# EAGLE board rjcar (EAGLE 5.10), part 1 of 2
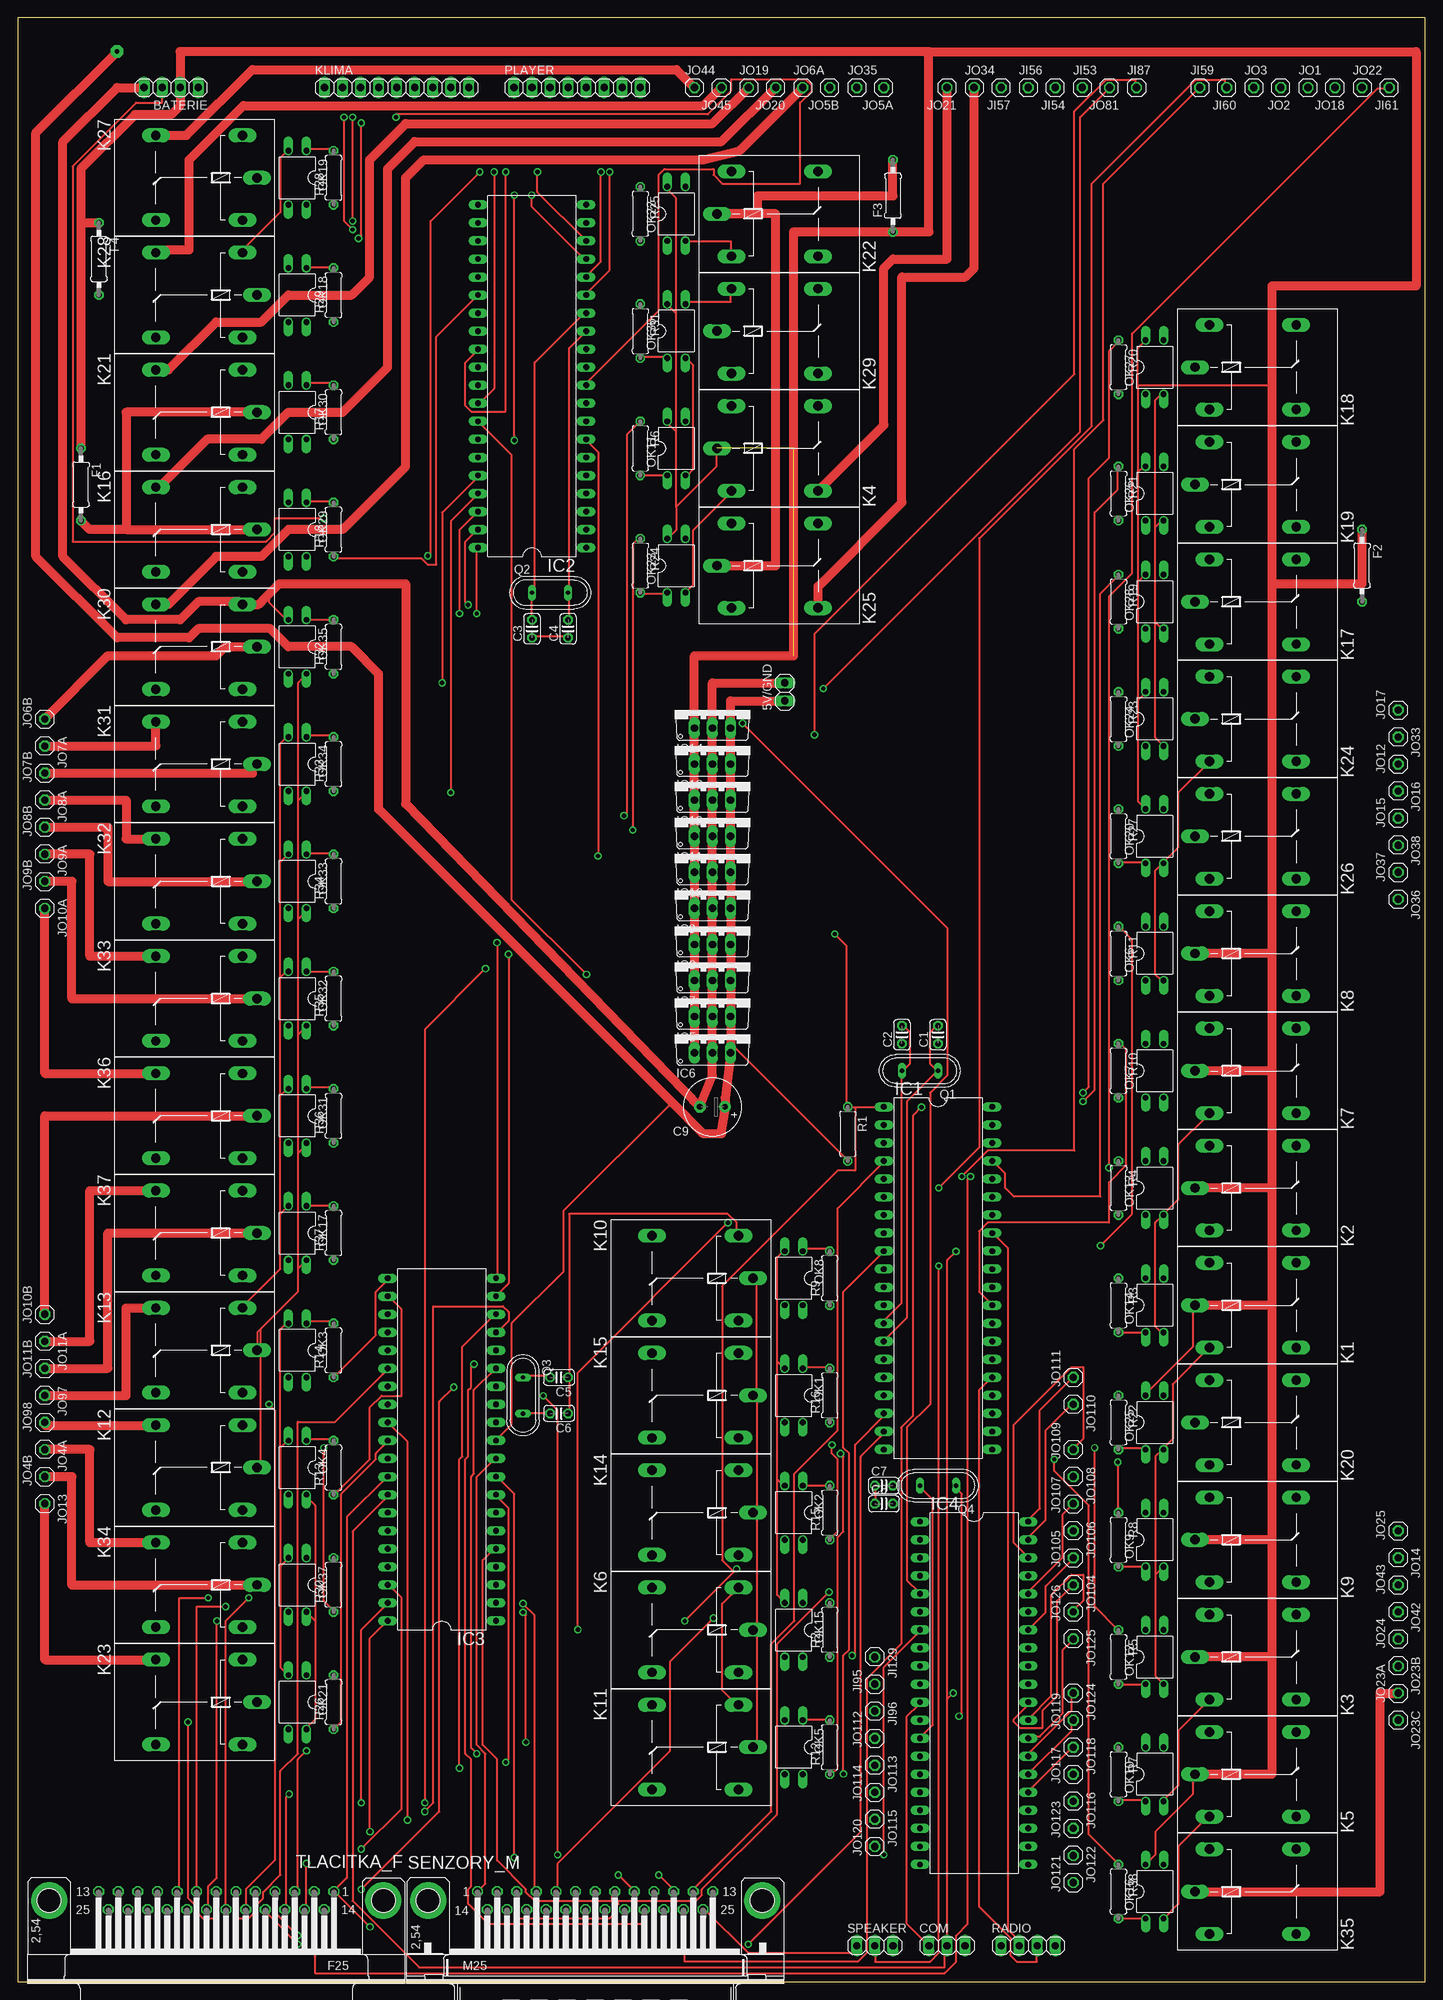
[diagram p2: board, top side]
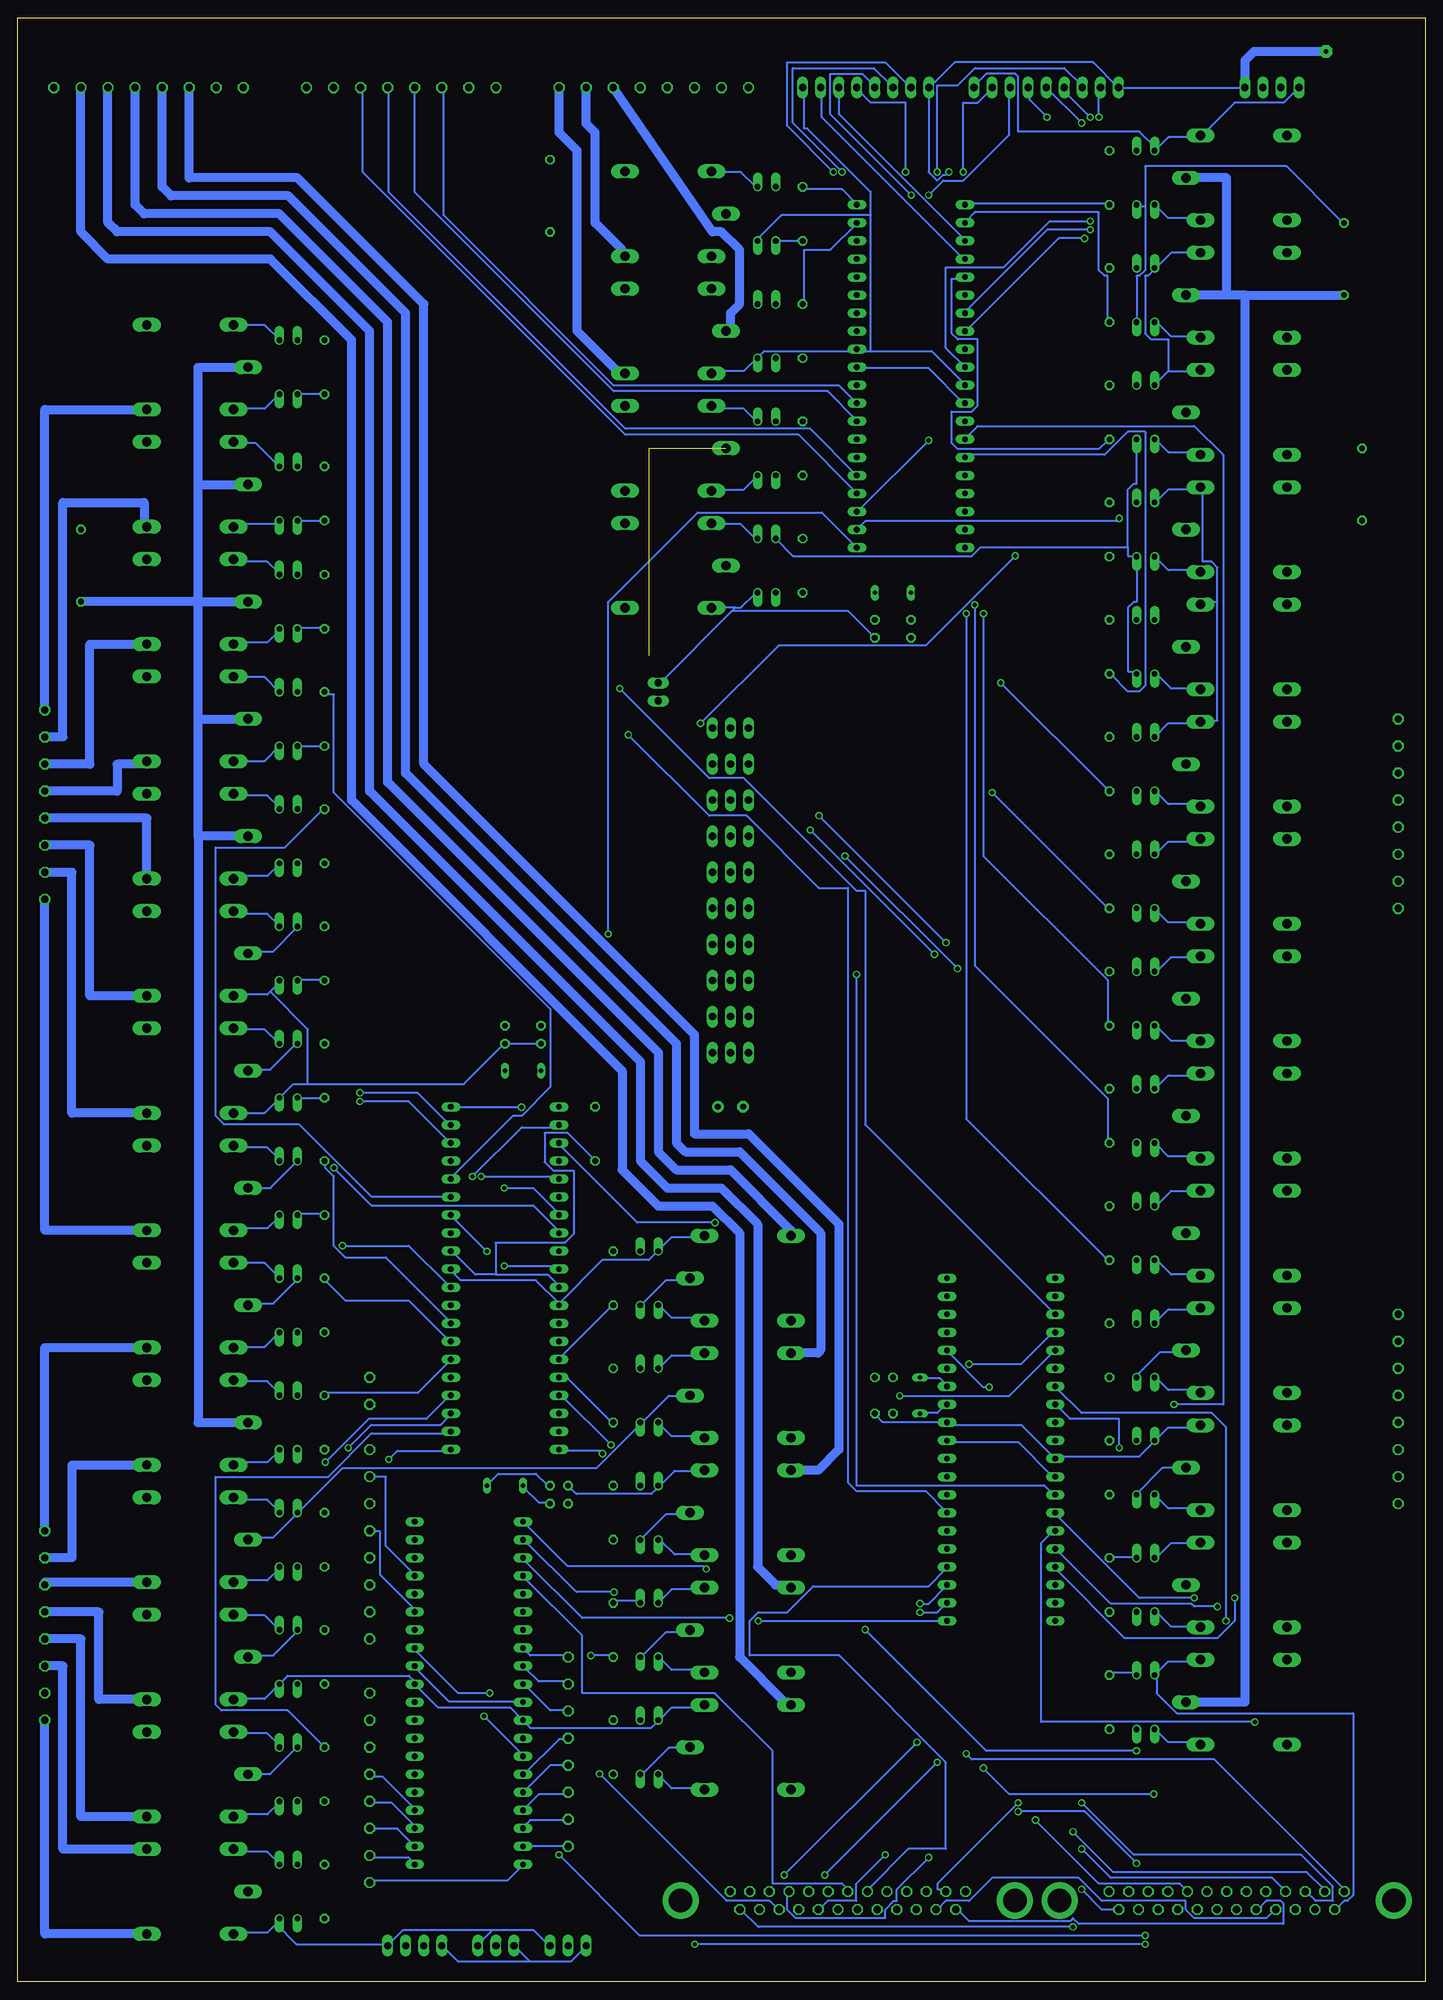
[diagram p3: board, bottom side, seen from below]

Size 198.1 x 276.53 mm. Coordinates in mm from the lower left corner, seen from the top.
Outline: 0,0 198.1,0 198.1,276.53 0,276.53 0,0
Copper layers (1*16): Top 0.035mm / dielectric 1.5mm / Bottom 0.035mm
Design rules "default": minimum track width 10mil, minimum drill 24mil, track to track 8mil, track to pad 8mil, pad to pad 8mil, via to via 8mil, smd to smd 8mil, copper to edge 40mil, drill to drill 8mil, minimum pad ring 10mil, minimum via ring 8mil, stop-mask expansion 4mil, vias tented up to drill 0mil, thermal gap 10mil

## Footprints (pad centres in the part's own frame; a part is rotated, then mirrored left to right if it is on the bottom)
1X02 = drill 1.016 long: 1 -1.27,0; 2 1.27,0
1X04 = drill 1.016 long: 1 -3.81,0; 2 -1.27,0; 3 1.27,0; 4 3.81,0
C025-024X044 = drill 0.813 octagon: 1 -1.27,0; 2 1.27,0
E3,5-8 = drill 0.813 pad 1.6 round: + -1.778,0 | drill 0.813 pad 1.6 octagon: - 1.778,0
1X03 = drill 1.016 long: 1 -2.54,0; 2 0,0; 3 2.54,0
0207/10 = drill 0.813 octagon: 1 -5.08,0; 2 5.08,0
DIL40 = drill 0.813 long: 1 -24.13,-7.62; 2 -21.59,-7.62; 3 -19.05,-7.62; 4 -16.51,-7.62; 5 -13.97,-7.62; 6 -11.43,-7.62; 7 -8.89,-7.62; 8 -6.35,-7.62; 9 -3.81,-7.62; 10 -1.27,-7.62; 11 1.27,-7.62; 12 3.81,-7.62; 13 6.35,-7.62; 14 8.89,-7.62; 15 11.43,-7.62; 16 13.97,-7.62; 17 16.51,-7.62; 18 19.05,-7.62; 19 21.59,-7.62; 20 24.13,-7.62; 21 24.13,7.62; 22 21.59,7.62; 23 19.05,7.62; 24 16.51,7.62; 25 13.97,7.62; 26 11.43,7.62; 27 8.89,7.62; 28 6.35,7.62; 29 3.81,7.62; 30 1.27,7.62; 31 -1.27,7.62; 32 -3.81,7.62; 33 -6.35,7.62; 34 -8.89,7.62; 35 -11.43,7.62; 36 -13.97,7.62; 37 -16.51,7.62; 38 -19.05,7.62; 39 -21.59,7.62; 40 -24.13,7.62
TO220V = drill 1.016 long: 1 -2.54,-2.54; 2 0,-2.54; 3 2.54,-2.54
1X01 = drill 1.016 octagon: 1 0,0
G5LE = drill 1.321 long: 1 -7.493,-5.969; 2 -7.493,5.969; O 4.699,5.969; P -9.525,0; S 4.699,-5.969
1X09 = drill 1.016 long: 1 -10.16,0; 2 -7.62,0; 3 -5.08,0; 4 -2.54,0; 5 0,0; 6 2.54,0; 7 5.08,0; 8 7.62,0; 9 10.16,0
DIL04 = drill 0.813 offset: 1 -1.27,-3.81; 2 1.27,-3.81; 3 1.27,3.81; 4 -1.27,3.81
1X08 = drill 1.016 long: 1 -8.89,0; 2 -6.35,0; 3 -3.81,0; 4 -1.27,0; 5 1.27,0; 6 3.81,0; 7 6.35,0; 8 8.89,0
QS = drill 0.61 long: 1 -2.54,0; 2 2.54,0
0207/7 = drill 0.813 octagon: 1 -3.81,0; 2 3.81,0
M25HP = drill 1.016 octagon: 1 -16.561,1.27; 2 -13.792,1.27; 3 -11.049,1.27; 4 -8.28,1.27; 5 -5.512,1.27; 6 -2.769,1.27; 7 0,1.27; 8 2.769,1.27; 9 5.512,1.27; 10 8.28,1.27; 11 11.049,1.27; 12 13.792,1.27; 13 16.561,1.27; 14 -15.189,-1.27; 15 -12.421,-1.27; 16 -9.652,-1.27; 17 -6.909,-1.27; 18 -4.14,-1.27; 19 -1.372,-1.27; 20 1.372,-1.27; 21 4.14,-1.27; 22 6.909,-1.27; 23 9.652,-1.27; 24 12.421,-1.27; 25 15.189,-1.27 | drill 3.302 pad 5.08 round: G1 -23.52,0; G2 23.52,0
F25HP = drill 1.016 octagon: 1 -16.561,-1.27; 2 -13.792,-1.27; 3 -11.049,-1.27; 4 -8.28,-1.27; 5 -5.512,-1.27; 6 -2.769,-1.27; 7 0,-1.27; 8 2.769,-1.27; 9 5.512,-1.27; 10 8.28,-1.27; 11 11.049,-1.27; 12 13.792,-1.27; 13 16.561,-1.27; 14 -15.189,1.27; 15 -12.421,1.27; 16 -9.652,1.27; 17 -6.909,1.27; 18 -4.14,1.27; 19 -1.372,1.27; 20 1.372,1.27; 21 4.14,1.27; 22 6.909,1.27; 23 9.652,1.27; 24 12.421,1.27; 25 15.189,1.27 | drill 3.302 pad 5.08 round: G1 -23.52,0; G2 23.52,0

## Placement (x,y rotation side)
5V/GND  [1X02]  107.95,181.61 90 top
BATERIE  [1X04]  21.59,266.7 180 top
C1  22p  [C025-024X044]  129.54,133.35 90 top
C2  22p  [C025-024X044]  124.46,133.35 90 top
C3  22p  [C025-024X044]  72.39,190.5 90 top
C4  22p  [C025-024X044]  77.47,190.5 90 top
C5  22p  [C025-024X044]  76.2,85.09 180 top
C6  22p  [C025-024X044]  76.2,80.01 180 top
C7  22p  [C025-024X044]  121.92,69.85 0 top
C8  22p  [C025-024X044]  121.92,67.31 0 top
C9  [E3,5-8]  97.79,123.19 180 top
COM  [1X03]  130.81,5.08 0 top
F1  [0207/10]  8.89,210.82 270 top
F2  [0207/10]  189.23,199.39 270 top
F3  [0207/10]  123.19,251.46 90 top
F4  [0207/10]  11.43,242.57 270 top
IC1  PIC16F874P  [DIL40]  129.54,99.06 270 top
IC2  PIC16F874P  [DIL40]  72.39,226.06 90 top
IC3  PIC16F874P  [DIL40]  59.69,74.93 90 top
IC4  PIC16F874P  [DIL40]  134.62,40.64 270 top
IC5  7805TV  [TO220V]  97.79,138.43 0 top
IC6  7805TV  [TO220V]  97.79,133.35 0 top
IC7  7805TV  [TO220V]  97.79,143.51 0 top
IC8  7805TV  [TO220V]  97.79,148.59 0 top
IC9  7805TV  [TO220V]  97.79,153.67 0 top
IC10  7805TV  [TO220V]  97.79,158.75 0 top
IC11  7805TV  [TO220V]  97.79,163.83 0 top
IC12  7805TV  [TO220V]  97.79,168.91 0 top
IC13  7805TV  [TO220V]  97.79,173.99 0 top
IC14  7805TV  [TO220V]  97.79,179.07 0 top
JI53  [1X01]  149.86,266.7 0 top
JI54  [1X01]  146.05,266.7 180 top
JI56  [1X01]  142.24,266.7 0 top
JI57  [1X01]  138.43,266.7 180 top
JI59  [1X01]  166.37,266.7 0 top
JI60  [1X01]  170.18,266.7 180 top
JI61  [1X01]  193.04,266.7 180 top
JI87  [1X01]  157.48,266.7 0 top
JI95  [1X01]  120.65,41.91 90 top
JI96  [1X01]  120.65,38.1 270 top
JI129  [1X01]  120.65,45.72 270 top
JO1  [1X01]  181.61,266.7 0 top
JO2  [1X01]  177.8,266.7 180 top
JO3  [1X01]  173.99,266.7 0 top
JO4A  [1X01]  3.81,74.93 270 top
JO4B  [1X01]  3.81,71.12 90 top
JO5A  [1X01]  121.92,266.7 180 top
JO5B  [1X01]  114.3,266.7 180 top
JO6A  [1X01]  110.49,266.7 0 top
JO6B  [1X01]  3.81,177.8 90 top
JO7A  [1X01]  3.81,173.99 270 top
JO7B  [1X01]  3.81,170.18 90 top
JO8A  [1X01]  3.81,166.37 270 top
JO8B  [1X01]  3.81,162.56 90 top
JO9A  [1X01]  3.81,158.75 270 top
JO9B  [1X01]  3.81,154.94 90 top
JO10A  [1X01]  3.81,151.13 270 top
JO10B  [1X01]  3.81,93.98 90 top
JO11A  [1X01]  3.81,90.17 270 top
JO11B  [1X01]  3.81,86.36 90 top
JO12  [1X01]  194.31,171.45 90 top
JO13  [1X01]  3.81,67.31 270 top
JO14  [1X01]  194.31,59.69 270 top
JO15  [1X01]  194.31,163.83 90 top
JO16  [1X01]  194.31,167.64 270 top
JO17  [1X01]  194.31,179.07 90 top
JO18  [1X01]  185.42,266.7 180 top
JO19  [1X01]  102.87,266.7 0 top
JO20  [1X01]  106.68,266.7 180 top
JO21  [1X01]  130.81,266.7 180 top
JO22  [1X01]  189.23,266.7 0 top
JO23A  [1X01]  194.31,40.64 90 top
JO23B  [1X01]  194.31,44.45 270 top
JO23C  [1X01]  194.31,36.83 270 top
JO24  [1X01]  194.31,48.26 90 top
JO25  [1X01]  194.31,63.5 90 top
JO33  [1X01]  194.31,175.26 270 top
JO34  [1X01]  134.62,266.7 0 top
JO35  [1X01]  118.11,266.7 0 top
JO36  [1X01]  194.31,152.4 270 top
JO37  [1X01]  194.31,156.21 90 top
JO38  [1X01]  194.31,160.02 270 top
JO42  [1X01]  194.31,52.07 270 top
JO43  [1X01]  194.31,55.88 90 top
JO44  [1X01]  95.25,266.7 0 top
JO45  [1X01]  99.06,266.7 180 top
JO81  [1X01]  153.67,266.7 180 top
JO97  [1X01]  3.81,82.55 270 top
JO98  [1X01]  3.81,78.74 90 top
JO104  [1X01]  148.59,55.88 270 top
JO105  [1X01]  148.59,59.69 90 top
JO106  [1X01]  148.59,63.5 270 top
JO107  [1X01]  148.59,67.31 90 top
JO108  [1X01]  148.59,71.12 270 top
JO109  [1X01]  148.59,74.93 90 top
JO110  [1X01]  148.59,81.28 270 top
JO111  [1X01]  148.59,85.09 90 top
JO112  [1X01]  120.65,34.29 90 top
JO113  [1X01]  120.65,30.48 270 top
JO114  [1X01]  120.65,26.67 90 top
JO115  [1X01]  120.65,22.86 270 top
JO116  [1X01]  148.59,25.4 270 top
JO117  [1X01]  148.59,29.21 90 top
JO118  [1X01]  148.59,33.02 270 top
JO119  [1X01]  148.59,36.83 90 top
JO120  [1X01]  120.65,19.05 90 top
JO121  [1X01]  148.59,13.97 90 top
JO122  [1X01]  148.59,17.78 270 top
JO123  [1X01]  148.59,21.59 90 top
JO124  [1X01]  148.59,40.64 270 top
JO125  [1X01]  148.59,48.26 270 top
JO126  [1X01]  148.59,52.07 90 top
K1  G5LE  [G5LE]  175.26,95.25 0 top
K2  G5LE  [G5LE]  175.26,111.76 0 top
K3  G5LE  [G5LE]  175.26,45.72 0 top
K4  G5LE  [G5LE]  107.95,215.9 0 top
K5  G5LE  [G5LE]  175.26,29.21 0 top
K6  G5LE  [G5LE]  93.98,49.53 180 top
K7  G5LE  [G5LE]  175.26,128.27 0 top
K8  G5LE  [G5LE]  175.26,144.78 0 top
K9  G5LE  [G5LE]  175.26,62.23 0 top
K10  G5LE  [G5LE]  93.98,99.06 180 top
K11  G5LE  [G5LE]  93.98,33.02 180 top
K12  G5LE  [G5LE]  24.13,72.39 180 top
K13  G5LE  [G5LE]  24.13,88.9 180 top
K14  G5LE  [G5LE]  93.98,66.04 180 top
K15  G5LE  [G5LE]  93.98,82.55 180 top
K16  G5LE  [G5LE]  24.13,204.47 180 top
K17  G5LE  [G5LE]  175.26,194.31 0 top
K18  G5LE  [G5LE]  175.26,227.33 0 top
K19  G5LE  [G5LE]  175.26,210.82 0 top
K20  G5LE  [G5LE]  175.26,78.74 0 top
K21  G5LE  [G5LE]  24.13,220.98 180 top
K22  G5LE  [G5LE]  107.95,248.92 0 top
K23  G5LE  [G5LE]  24.13,39.37 180 top
K24  G5LE  [G5LE]  175.26,177.8 0 top
K25  G5LE  [G5LE]  107.95,199.39 0 top
K26  G5LE  [G5LE]  175.26,161.29 0 top
K27  G5LE  [G5LE]  24.13,254 180 top
K28  G5LE  [G5LE]  24.13,237.49 180 top
K29  G5LE  [G5LE]  107.95,232.41 0 top
K30  G5LE  [G5LE]  24.13,187.96 180 top
K31  G5LE  [G5LE]  24.13,171.45 180 top
K32  G5LE  [G5LE]  24.13,154.94 180 top
K33  G5LE  [G5LE]  24.13,138.43 180 top
K34  G5LE  [G5LE]  24.13,55.88 180 top
K35  G5LE  [G5LE]  175.26,12.7 0 top
K36  G5LE  [G5LE]  24.13,121.92 180 top
K37  G5LE  [G5LE]  24.13,105.41 180 top
KLIMA  [1X09]  53.34,266.7 0 top
OK1  PC817  [DIL04]  109.22,82.55 180 top
OK2  PC817  [DIL04]  109.22,66.04 180 top
OK3  PC817  [DIL04]  39.37,88.9 180 top
OK4  PC817  [DIL04]  39.37,72.39 180 top
OK5  PC817  [DIL04]  109.22,33.02 180 top
OK6  PC817  [DIL04]  160.02,144.78 0 top
OK7  PC817  [DIL04]  160.02,128.27 0 top
OK8  PC817  [DIL04]  109.22,99.06 180 top
OK9  PC817  [DIL04]  160.02,62.23 0 top
OK10  PC817  [DIL04]  160.02,29.21 0 top
OK11  PC817  [DIL04]  92.71,215.9 0 top
OK12  PC817  [DIL04]  160.02,45.72 0 top
OK13  PC817  [DIL04]  160.02,111.76 0 top
OK14  PC817  [DIL04]  160.02,95.25 0 top
OK15  PC817  [DIL04]  109.22,49.53 180 top
OK16  PC817  [DIL04]  160.02,12.7 0 top
OK17  PC817  [DIL04]  39.37,105.41 180 top
OK18  PC817  [DIL04]  39.37,237.49 180 top
OK19  PC817  [DIL04]  39.37,254 180 top
OK20  PC817  [DIL04]  160.02,161.29 0 top
OK21  PC817  [DIL04]  39.37,39.37 180 top
OK22  PC817  [DIL04]  92.71,248.92 0 top
OK23  PC817  [DIL04]  92.71,199.39 0 top
OK24  PC817  [DIL04]  160.02,177.8 0 top
OK25  PC817  [DIL04]  160.02,78.74 0 top
OK26  PC817  [DIL04]  160.02,209.55 0 top
OK27  PC817  [DIL04]  160.02,227.33 0 top
OK28  PC817  [DIL04]  160.02,194.31 0 top
OK29  PC817  [DIL04]  39.37,204.47 180 top
OK30  PC817  [DIL04]  39.37,220.98 180 top
OK31  PC817  [DIL04]  39.37,121.92 180 top
OK32  PC817  [DIL04]  39.37,138.43 180 top
OK33  PC817  [DIL04]  39.37,154.94 180 top
OK34  PC817  [DIL04]  39.37,171.45 180 top
OK35  PC817  [DIL04]  39.37,187.96 180 top
OK36  PC817  [DIL04]  92.71,232.41 0 top
OK37  PC817  [DIL04]  39.37,55.88 180 top
PLAYER  [1X08]  78.74,266.7 0 top
Q1  10MHz  [QS]  127,128.27 180 top
Q2  10MHz  [QS]  74.93,195.58 0 top
Q3  10MHz  [QS]  71.12,82.55 270 top
Q4  10MHz  [QS]  129.54,69.85 180 top
R1  5k  [0207/7]  116.84,119.38 270 top
R2  1k1  [0207/7]  114.3,49.53 90 top
R3  1k1  [0207/7]  154.94,95.25 270 top
R4  1k1  [0207/7]  154.94,111.76 270 top
R5  1k1  [0207/7]  154.94,45.72 270 top
R6  1k1  [0207/7]  87.63,215.9 270 top
R7  1k1  [0207/7]  154.94,29.21 270 top
R8  1k1  [0207/7]  154.94,62.23 270 top
R9  1k1  [0207/7]  114.3,99.06 90 top
R10  1k1  [0207/7]  154.94,128.27 270 top
R11  1k1  [0207/7]  154.94,144.78 270 top
R12  1k1  [0207/7]  114.3,33.02 90 top
R13  1k1  [0207/7]  44.45,72.39 90 top
R14  1k1  [0207/7]  44.45,88.9 90 top
R15  1k1  [0207/7]  114.3,66.04 90 top
R16  1k1  [0207/7]  114.3,82.55 90 top
R17  1k1  [0207/7]  44.45,220.98 90 top
R18  1k1  [0207/7]  44.45,204.47 90 top
R19  1k1  [0207/7]  154.94,194.31 270 top
R20  1k1  [0207/7]  154.94,227.33 270 top
R21  1k1  [0207/7]  154.94,209.55 270 top
R22  1k1  [0207/7]  154.94,78.74 270 top
R23  1k1  [0207/7]  154.94,177.8 270 top
R24  1k1  [0207/7]  87.63,199.39 270 top
R25  1k1  [0207/7]  87.63,248.92 270 top
R26  1k1  [0207/7]  44.45,39.37 90 top
R27  1k1  [0207/7]  154.94,161.29 270 top
R28  1k1  [0207/7]  44.45,254 90 top
R29  1k1  [0207/7]  44.45,237.49 90 top
R30  1k1  [0207/7]  44.45,55.88 90 top
R31  1k1  [0207/7]  87.63,232.41 270 top
R32  1k1  [0207/7]  44.45,187.96 90 top
R33  1k1  [0207/7]  44.45,171.45 90 top
R34  1k1  [0207/7]  44.45,154.94 90 top
R35  1k1  [0207/7]  44.45,138.43 90 top
R36  1k1  [0207/7]  44.45,121.92 90 top
R37  1k1  [0207/7]  44.45,105.41 90 top
R38  1k1  [0207/7]  154.94,12.7 270 top
RADIO  [1X04]  142.24,5.08 0 top
SENZORY_M  [M25HP]  81.28,11.43 0 top
SPEAKER  [1X03]  120.65,5.08 0 top
TLACITKA_F  [F25HP]  27.94,11.43 180 top